# EAGLE schematic mulato-32m (EAGLE 6.4)
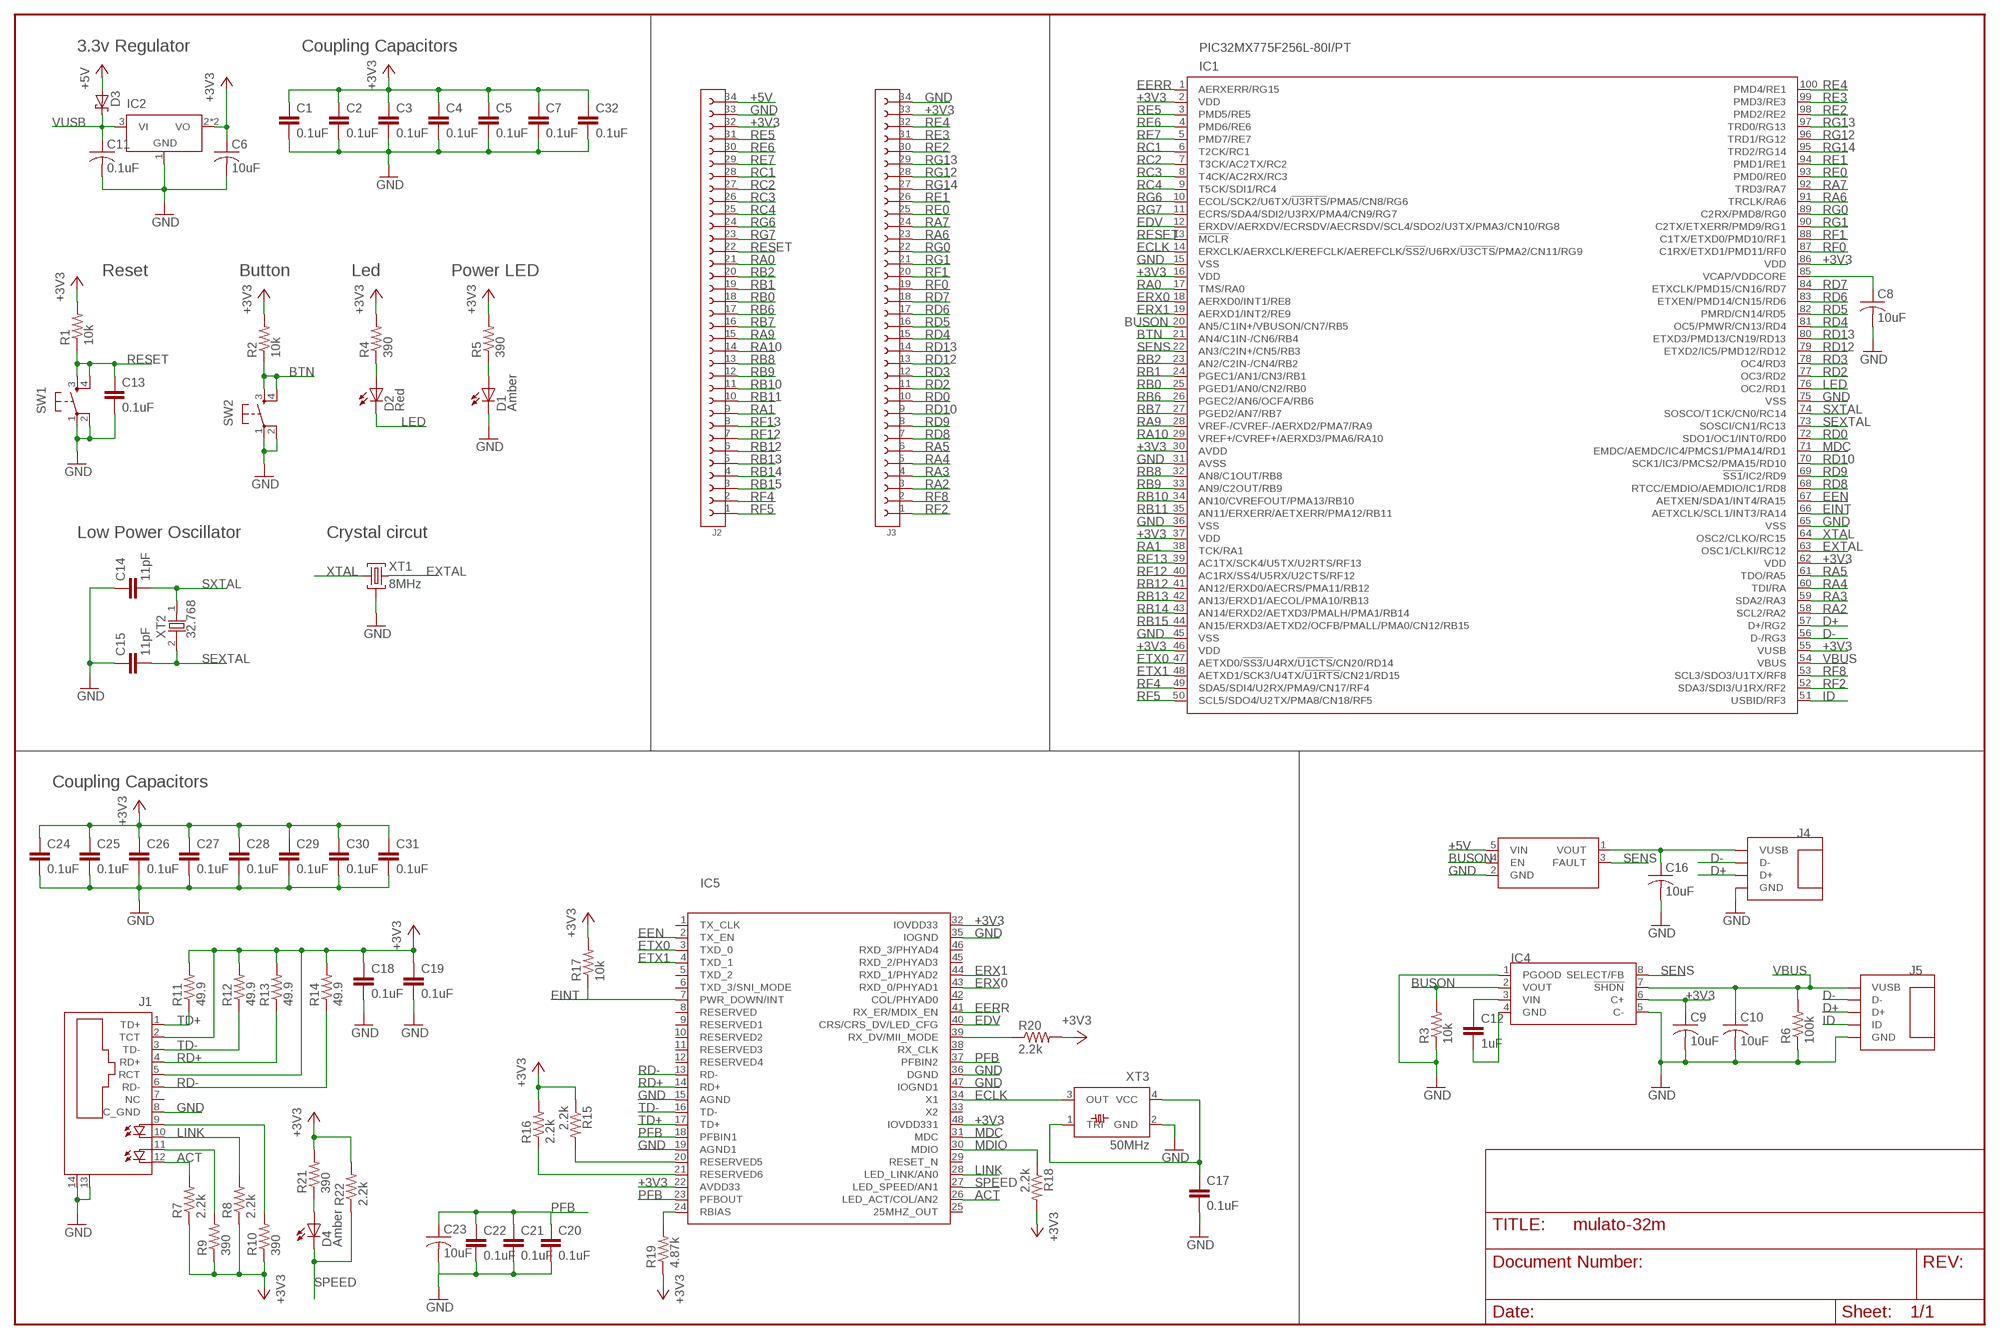
[diagram p0: schematic, sheet 1]

## Parts
C1  0.1uF  C0603C104Z3VAC  [CAPC0603]
C2  0.1uF  C0603C104Z3VAC  [CAPC0603]
C3  0.1uF  C0603C104Z3VAC  [CAPC0603]
C4  0.1uF  C0603C104Z3VAC  [CAPC0603]
C5  0.1uF  C0603C104Z3VAC  [CAPC0603]
C6  10uF  T491A106K016AT  [CAPMP3216-18]
C7  0.1uF  C0603C104Z3VAC  [CAPC0603]
C8  10uF  T491A106K016AT  [CAPMP3216-18]
C9  10uF  T491A106K016AT  [CAPMP3216-18]
C10  10uF  T491A106K016AT  [CAPMP3216-18]
C11  0.1uF  T491A104K050AT  [CAPMP3216-18]
C12  1uF  C0805C105K4RAC  [CAPC0805]
C13  0.1uF  C0603C104Z3VAC  [CAPC0603]
C14  11pF  C0603C110J5GAC  [CAPC0603]
C15  11pF  C0603C110J5GAC  [CAPC0603]
C16  10uF  T491A106K016AT  [CAPMP3216-18]
C17  0.1uF  C0603C104Z3VAC  [CAPC0603]
C18  0.1uF  C0603C104Z3VAC  [CAPC0603]
C19  0.1uF  C0603C104Z3VAC  [CAPC0603]
C20  0.1uF  C0603C104Z3VAC  [CAPC0603]
C21  0.1uF  C0603C104Z3VAC  [CAPC0603]
C22  0.1uF  C0603C104Z3VAC  [CAPC0603]
C23  10uF  T491A106K016AT  [CAPMP3216-18]
C24  0.1uF  C0603C104Z3VAC  [CAPC0603]
C25  0.1uF  C0603C104Z3VAC  [CAPC0603]
C26  0.1uF  C0603C104Z3VAC  [CAPC0603]
C27  0.1uF  C0603C104Z3VAC  [CAPC0603]
C28  0.1uF  C0603C104Z3VAC  [CAPC0603]
C29  0.1uF  C0603C104Z3VAC  [CAPC0603]
C30  0.1uF  C0603C104Z3VAC  [CAPC0603]
C31  0.1uF  C0603C104Z3VAC  [CAPC0603]
C32  0.1uF  C0603C104Z3VAC  [CAPC0603]
D1  Amber  SM0805AC  [D0805]
D2  Red  SM0805HC  [D0805]
D3  MBR0530T1G  [SOT123160X270-2N]
D4  Amber  SM0805AC  [D0805]
IC1  PIC32MX775F256L-80I/PT  [QFP40P1400X1400X100-100N]
IC2  LD1117S33TR  [SOT230P700X180-4N]
IC3  SMTPS2141STR  [SOT95P280X100-5M]
IC4  MCP1253-33X50I/MS  [SOP65P490X109-8M]
IC5  DP83848C  [QFP50P900X900X160-48M]
J1  6605425-1  [RJ45-8N-2LEDS]
J2  61303411121  [PHSP254P8636X254X1154-34S]
J3  61303411121  [PHSP254P8636X254X1154-34S]
J4  292303-1  [USB-A]
J5  1981584-1  [USB-MICRO-B]
R1  10k  CRG0603F10K10  [RESC0603]
R2  10k  CRG0603F10K10  [RESC0603]
R3  10k  CRG0603F10K10  [RESC0603]
R4  390  CRG0603F390R  [RESC0603]
R5  390  CRG0603F390R  [RESC0603]
R6  100k  CRG0603F100K  [RESC0603]
R7  2.2k  CRG0603F2K2  [RESC0603]
R8  2.2k  CRG0603F2K2  [RESC0603]
R9  390  CRG0603F390R  [RESC0603]
R10  390  CRG0603F390R  [RESC0603]
R11  49.9  CRG0603F49R9  [RESC0603]
R12  49.9  CRG0603F49R9  [RESC0603]
R13  49.9  CRG0603F49R9  [RESC0603]
R14  49.9  CRG0603F49R9  [RESC0603]
R15  2.2k  CRG0603F2K2  [RESC0603]
R16  2.2k  CRG0603F2K2  [RESC0603]
R17  10k  CRG0603F10K10  [RESC0603]
R18  2.2k  CRG0603F2K2  [RESC0603]
R19  4.87k  CRG0603F4K87  [RESC0603]
R20  2.2k  CRG0603F2K2  [RESC0603]
R21  390  CRG0603F390R  [RESC0603]
R22  2.2k  CRG0603F2K2  [RESC0603]
SW1  TL3301NF160QJ  [TACT600X600-4J]
SW2  TL3301NF160QJ  [TACT600X600-4J]
XT1  8MHz  AWSCR-8.00MGD-C  [CERAMIC740X340-3N]
XT2  32.768  ABS07-120-32.768KHZ-T  [CEMIC320X150-2N]
XT3  50MHz  ASE-50.000MHZ-ET'  [CEMIC320X250-4N]

## Nets
+3V3: C1.1 C2.1 C3.1 C4.1 C5.1 C6.1 C7.1 C9.1 C18.1 C19.1 C24.1 C25.1 C26.1 C27.1 C28.1 C29.1 C30.1 C31.1 C32.1 IC1.2(VDD) IC1.16(VDD) IC1.30(AVDD) IC1.37(VDD) IC1.46(VDD) IC1.55(VUSB) IC1.62(VDD) IC1.86(VDD) IC2.2(VO) IC2.4(VO) IC4.6(C+) IC5.22(AVDD33) IC5.32(IOVDD33) IC5.48(IOVDD331) J1.2(TCT) J1.5(RCT) J2.32 J3.33 R1.P$2 R2.P$2 R4.P$2 R5.P$2 R7.P$1 R8.P$1 R9.P$1 R10.P$1 R11.P$2 R12.P$2 R13.P$2 R14.P$2 R15.P$1 R16.P$2 R17.P$2 R18.P$2 R19.P$1 R20.P$2 R21.P$2 R22.P$2
+5V: D3.1(A) IC3.5(VIN) J2.34
ACT: IC5.26(LED_ACT/COL/AN2) J1.12(C1) R7.P$2
BTN: IC1.21(AN4/C1IN-/CN6/RB4) R2.P$1 SW2.3(S) SW2.4(S1)
BUSON: IC1.20(AN5/C1IN+/VBUSON/CN7/RB5) IC3.4(EN) IC4.2(VOUT) R3.P$2
D+: IC1.57(D+/RG2) J4.2(D+) J5.3(D+)
D-: IC1.56(D-/RG3) J4.3(D-) J5.2(D-)
ECLK: IC1.14(ERXCLK/AERXCLK/EREFCLK/AEREFCLK/!SS2!/U6RX/!U3CTS!/PMA2/CN11/RG9) IC5.34(X1) XT3.3(OUT)
EDV: IC1.12(ERXDV/AERXDV/ECRSDV/AECRSDV/SCL4/SDO2/U3TX/PMA3/CN10/RG8) IC5.40(CRS/CRS_DV/LED_CFG)
EEN: IC1.67(AETXEN/SDA1/INT4/RA15) IC5.2(TX_EN)
EERR: IC1.1(AERXERR/RG15) IC5.41(RX_ER/MDIX_EN)
EINT: IC1.66(AETXCLK/SCL1/INT3/RA14) IC5.7(PWR_DOWN/INT) R17.P$1
ERX0: IC1.18(AERXD0/INT1/RE8) IC5.43(RXD_0/PHYAD1)
ERX1: IC1.19(AERXD1/INT2/RE9) IC5.44(RXD_1/PHYAD2)
ETX0: IC1.47(AETXD0/!SS3!/U4RX/!U1CTS!/CN20/RD14) IC5.3(TXD_0)
ETX1: IC1.48(AETXD1/SCK3/U4TX/!U1RTS!/CN21/RD15) IC5.4(TXD_1)
EXTAL: IC1.63(OSC1/CLKI/RC12) XT1.3
GND: C1.2 C2.2 C3.2 C4.2 C5.2 C6.2 C7.2 C8.2 C9.2 C10.2 C11.2 C13.2 C14.1 C15.1 C16.2 C17.2 C18.2 C19.2 C20.2 C21.2 C22.2 C23.2 C24.2 C25.2 C26.2 C27.2 C28.2 C29.2 C30.2 C31.2 C32.2 D1.2(C) IC1.15(VSS) IC1.31(AVSS) IC1.36(VSS) IC1.45(VSS) IC1.65(VSS) IC1.75(VSS) IC2.1(GND) IC3.2(GND) IC4.1(PGOOD) IC4.5(C-) IC5.15(AGND) IC5.19(AGND1) IC5.35(IOGND) IC5.36(DGND) IC5.47(IOGND1) J1.8(C_GND) J1.13(CH1) J1.14(CH2) J2.33 J3.34 J4.4(GND) J5.5(GND) R3.P$1 R6.P$1 SW1.1(P) SW1.2(P1) SW2.1(P) SW2.2(P1) XT1.2 XT3.2(GND)
ID: IC1.51(USBID/RF3) J5.4(ID)
LED: D2.2(C) IC1.76(OC2/RD1)
LINK: IC5.28(LED_LINK/AN0) J1.10(C) R8.P$2
MDC: IC1.71(EMDC/AEMDC/IC4/PMCS1/PMA14/RD1) IC5.31(MDC)
MDIO: IC5.30(MDIO) R18.P$1
N$1: C8.1 IC1.85(VCAP/VDDCORE)
N$2: C17.1 XT3.1(TRI) XT3.4(VCC)
N$3: IC5.21(RESERVED6) R16.P$1
N$4: IC5.20(RESERVED5) R15.P$2
N$5: J1.11(A1) R9.P$2
N$6: C16.1 IC3.1(VOUT) J4.1(VUSB)
N$8: C12.1 IC4.3(VIN)
N$9: D1.1(A) R5.P$1
N$10: D2.1(A) R4.P$1
N$11: C12.2 IC4.4(GND)
N$12: J1.9(A) R10.P$2
N$13: IC5.24(RBIAS) R19.P$2
N$14: IC5.39(RX_DV/MII_MODE) R20.P$1
N$15: D4.1(A) R21.P$1
PFB: C20.1 C21.1 C22.1 C23.1 IC5.18(PFBIN1) IC5.23(PFBOUT) IC5.37(PFBIN2)
RA0: IC1.17(TMS/RA0) J2.21
RA1: IC1.38(TCK/RA1) J2.9
RA2: IC1.58(SCL2/RA2) J3.3
RA3: IC1.59(SDA2/RA3) J3.4
RA4: IC1.60(TDI/RA) J3.5
RA5: IC1.61(TDO/RA5) J3.6
RA6: IC1.91(TRCLK/RA6) J3.23
RA7: IC1.92(TRD3/RA7) J3.24
RA9: IC1.28(VREF-/CVREF-/AERXD2/PMA7/RA9) J2.15
RA10: IC1.29(VREF+/CVREF+/AERXD3/PMA6/RA10) J2.14
RB0: IC1.25(PGED1/AN0/CN2/RB0) J2.18
RB1: IC1.24(PGEC1/AN1/CN3/RB1) J2.19
RB2: IC1.23(AN2/C2IN-/CN4/RB2) J2.20
RB6: IC1.26(PGEC2/AN6/OCFA/RB6) J2.17
RB7: IC1.27(PGED2/AN7/RB7) J2.16
RB8: IC1.32(AN8/C1OUT/RB8) J2.13
RB9: IC1.33(AN9/C2OUT/RB9) J2.12
RB10: IC1.34(AN10/CVREFOUT/PMA13/RB10) J2.11
RB11: IC1.35(AN11/ERXERR/AETXERR/PMA12/RB11) J2.10
RB12: IC1.41(AN12/ERXD0/AECRS/PMA11/RB12) J2.6
RB13: IC1.42(AN13/ERXD1/AECOL/PMA10/RB13) J2.5
RB14: IC1.43(AN14/ERXD2/AETXD3/PMALH/PMA1/RB14) J2.4
RB15: IC1.44(AN15/ERXD3/AETXD2/OCFB/PMALL/PMA0/CN12/RB15) J2.3
RC1: IC1.6(T2CK/RC1) J2.28
RC2: IC1.7(T3CK/AC2TX/RC2) J2.27
RC3: IC1.8(T4CK/AC2RX/RC3) J2.26
RC4: IC1.9(T5CK/SDI1/RC4) J2.25
RD0: IC1.72(SDO1/OC1/INT0/RD0) J3.10
RD2: IC1.77(OC3/RD2) J3.11
RD3: IC1.78(OC4/RD3) J3.12
RD4: IC1.81(OC5/PMWR/CN13/RD4) J3.15
RD5: IC1.82(PMRD/CN14/RD5) J3.16
RD6: IC1.83(ETXEN/PMD14/CN15/RD6) J3.17
RD7: IC1.84(ETXCLK/PMD15/CN16/RD7) J3.18
RD8: IC1.68(RTCC/EMDIO/AEMDIO/IC1/RD8) J3.7
RD9: IC1.69(!SS1!/IC2/RD9) J3.8
RD10: IC1.70(SCK1/IC3/PMCS2/PMA15/RD10) J3.9
RD12: IC1.79(ETXD2/IC5/PMD12/RD12) J3.13
RD13: IC1.80(ETXD3/PMD13/CN19/RD13) J3.14
RD+: IC5.14(RD+) J1.4(RD+) R13.P$1
RD-: IC5.13(RD-) J1.6(RD-) R14.P$1
RE0: IC1.93(PMD0/RE0) J3.25
RE1: IC1.94(PMD1/RE1) J3.26
RE2: IC1.98(PMD2/RE2) J3.30
RE3: IC1.99(PMD3/RE3) J3.31
RE4: IC1.100(PMD4/RE1) J3.32
RE5: IC1.3(PMD5/RE5) J2.31
RE6: IC1.4(PMD6/RE6) J2.30
RE7: IC1.5(PMD7/RE7) J2.29
RESET: C13.1 IC1.13(!MCLR) J2.22 R1.P$1 SW1.3(S) SW1.4(S1)
RF0: IC1.87(C1RX/ETXD1/PMD11/RF0) J3.19
RF1: IC1.88(C1TX/ETXD0/PMD10/RF1) J3.20
RF2: IC1.52(SDA3/SDI3/U1RX/RF2) J3.1
RF4: IC1.49(SDA5/SDI4/U2RX/PMA9/CN17/RF4) J2.2
RF5: IC1.50(SCL5/SDO4/U2TX/PMA8/CN18/RF5) J2.1
RF8: IC1.53(SCL3/SDO3/U1TX/RF8) J3.2
RF12: IC1.40(AC1RX/SS4/U5RX/U2CTS/RF12) J2.7
RF13: IC1.39(AC1TX/SCK4/U5TX/U2RTS/RF13) J2.8
RG0: IC1.89(C2RX/PMD8/RG0) J3.22
RG1: IC1.90(C2TX/ETXERR/PMD9/RG1) J3.21
RG6: IC1.10(ECOL/SCK2/U6TX/!U3RTS!/PMA5/CN8/RG6) J2.24
RG7: IC1.11(ECRS/SDA4/SDI2/U3RX/PMA4/CN9/RG7) J2.23
RG12: IC1.96(TRD1/RG12) J3.28
RG13: IC1.97(TRD0/RG13) J3.29
RG14: IC1.95(TRD2/RG14) J3.27
SENS: IC1.22(AN3/C2IN+/CN5/RB3) IC3.3(FAULT) IC4.8(SELECT/FB)
SEXTAL: C15.2 IC1.73(SOSCI/CN1/RC13) XT2.2
SPEED: D4.2(C) IC5.27(LED_SPEED/AN1) R22.P$1
SXTAL: C14.2 IC1.74(SOSCO/T1CK/CN0/RC14) XT2.1
TD+: IC5.17(TD+) J1.1(TD+) R11.P$1
TD-: IC5.16(TD-) J1.3(TD-) R12.P$1
VBUS: C10.1 IC1.54(VBUS) IC4.7(!SHDN) J5.1(VUSB) R6.P$2
VUSB: C11.1 D3.2(C) IC2.3(VI)
XTAL: IC1.64(OSC2/CLKO/RC15) XT1.1
Unconnected: IC5.1(TX_CLK) IC5.5(TXD_2) IC5.6(TXD_3/SNI_MODE) IC5.8(RESERVED) IC5.9(RESERVED1) IC5.10(RESERVED2) IC5.11(RESERVED3) IC5.12(RESERVED4) IC5.25(25MHZ_OUT) IC5.29(RESET_N) IC5.33(X2) IC5.38(RX_CLK) IC5.42(COL/PHYAD0) IC5.45(RXD_2/PHYAD3) IC5.46(RXD_3/PHYAD4) J1.7(NC)

## Notes on the sheet
- 3.3v Regulator | Coupling Capacitors
- Reset | Button | Led | Power LED
- Low Power Oscillator | Crystal circut
- Coupling Capacitors

## Library data of the parts
C1-C5 C7 C13 C17-C22 C24-C32 = kemet-capacitors-ceramic:C?C*VAC: Y5V Dielectric, 6.3 – 50 VDC (Commercial Grade) Description OVERVIEW: KEMET’s Y5V dielectric features an 85°C maximum operating temperature and is considered “general-purpose.” The Electronics Components, Assemblies & Materials Association (EIA) characterizes Z5U dielectric as a Class III material. Components of this classiﬁ cation are ﬁ xed, ceramic dielectric capacitors suited for bypass and decoupling or other applications in which dielectric losses, high insulation resistance and capacitance stability are not of major importance. Y5V exhibits a predictable change in capacitance with respect to time and voltage and displays wide variations in capacitance with reference to ambient temperature. Capacitance change is limited to +22%, -82% from -30°C to +85°C. APPLICATIONS: Typical applications include limited temperature, decoupling and bypass. BENEFITS • -30°C to +85°C operating temperature range • Pb-Free and RoHS Compliant • EIA 0402, 0603, 0805, 1206, and 1210 case sizes • DC voltage ratings of 6.3 V, 10 V, 16 V, 25 V, and 50 V • Capacitance offerings ranging from 0.022 μF to 22 μF • Available capacitance tolerance of +80%/ -20% • Non-polar device, minimizing installation concerns • 100% pure matte tin-plated termination ﬁ nish that allowing for excellent solderability How to Order C 1210 C 226 Z 4 V A C TU Capacitor Class Case Size Specification Series Capacitance Code (pF) Capacitance Tolerance Voltage Dielectric Failure Rate/Design Termination Finish Packaging Grade C = Ceramic 0402 0603 0805 1206 1210 C = Standart 2 signiﬁ cant digits + number of zeros. Use 9 for 1.0 – 9.9 pF Use 8 for 0.5 – .99 pF e.g., 2.2 pF = 229 e.g., 0.5 pF = 508 Z = +80%/-20% 9 = 6.3V 8 = 10V 4 = 16V 3 = 25V 5 = 50 V V = Y5V A = N/A A = 100% Matte Blank = Bulk TU = 7" Reel Unmarked. Ref: Datasheet <http://www.kemet.com/kemet/web/homepage/kechome.nsf/weben/B79D94FAACCDEFCE852579F10063745E/$file/KEM_CC101_COMM_SMD.pdf> Add more variants to C@VAC, just remplace the "@" with a new technologie named according to order code parameters. It is mandatory to fill up the following attributes MANUFACTURER, DESCRIPTION, MOUSER, AVNET, ARROW, FUTURE, NEWARK, DIGIKEY, AVRG-PRICE, OCTOPART-LINK, DATASHEET; AVNET: C0603C104Z3VAC TU; AVRG-PRICE: 0.1; DATASHEET: http://www.kemet.com/kemet/web/homepage/kechome.nsf/weben/B79D94FAACCDEFCE852579F10063745E/$file/KEM_CC101_COMM_SMD.pdf; DESCRIPTION: Capacitores cerámicos de capas múltiples (MLCC) - SMD/SMT0603 25volts 0.1uF Y5V -20+80%; DIGIKEY: 399-1100-2-ND; EAGLEUP: CAPC0603; MANUFACTURER: KEMET; MOUSER: 80-C0603C104Z3V; NEWARK: 31C9013; OCTOPART-LINK: http://octopart.com/c0603c104z3vactu-kemet-98662
C6 C8-C10 C16 C23 = kemet-capacitors-tantalum:T491?*: T491 Industrial Grade MnO2 Series Description OVERVIEW The KEMET T491 Series, designed speciﬁ cally for today’s highly automated surface mount processes and equipment, is the leading choice for surface mount designs. The T491 combines KEMET’s proven solid tantalum technology, acclaimed and respected throughout the world, with the latest in materials, processes and automation, resulting in unsurpassed total performance and value APPLICATIONS Typical applications include decoupling and ﬁ ltering in industrial and automotive end applications such as DC/DC converters, portable electronics, telecommunications, and control units. BENEFITS: • Taped and reeled per EIA 481–1 • Symmetrical, compliant terminations • Optical gold-plated terminations • Laser-marked case • 100% surge current test on C, D, E, U, V, X sizes • Halogen free epoxy • Capacitance 0.1 µF to 1,000 µF • Tolerance ±10%, ±20% • Voltage 2.5 – 50 VDC • Extended range values • Low proﬁ le case sizes • RoHS Compliant and lead-free terminations (See www.kemet.com for transition information) • Operating temperature: -55ºC to +125ºC How to Order T 491 X 157 K 020 A T Capacitor Class Series Case Size Capacitance Code (pF) Capacitance Tolerance Voltage Failure Rate/ Design Lead Material Packaging (C-Spec) T = Tantalum Industrial A, B, C, D, E, R, S, T, U, V, X First two digits represent signiﬁ cant ﬁgures. Third digit speciﬁ es number of zeros. K = ±10% M = ±20% 2R5 = 2.5 V 003 = 3 V 004 = 4 V 006 = 6.3 V 010 = 10 V 016 = 16 V 020 = 20 V 025 = 25 V 035 = 35 V 050 = 50 V A = N/A T = 100% Matte Tin (Sn) Plated* H = Standard Solder Coated (SnPb 5% Pb minimum) G = Gold Plated (A, B, C, D, X only) N = Non-Magnetic 100% Tin (Sn) M = Non-Magnetic (SnPb) Blank = 7" Reel 7280 = 13" Ree Ref: Datasheet <http://www.kemet.com/kemet/web/homepage/kechome.nsf/weben/9F2DE33590D9247E8525788D0059B1E1/$file/KEM_TC101_STD.pdf> Add more variants to T491@, just remplace the "@" with a new technologie named according to order code parameters. It is mandatory to fill up the following attributes MANUFACTURER, DESCRIPTION, MOUSER, AVNET, ARROW, FUTURE, NEWARK, DIGIKEY, AVRG-PRICE, OCTOPART-LINK, DATASHEET; AVRG-PRICE: 0.18; DATASHEET: http://www.kemet.com/kemet/web/homepage/kechome.nsf/weben/9F2DE33590D9247E8525788D0059B1E1/$file/KEM_TC101_STD.pdf; DESCRIPTION: Capacitores de tantalio - SMD sólido 16volt 10uF 10% Lead Free; DIGIKEY: 399-8269-2-ND; EAGLEUP: CAPMP3216-18; MANUFACTURER: KEMET; MOUSER: 80-T491A106K016; OCTOPART-LINK: http://octopart.com/t491a106k016at-kemet-145880
C11 = kemet-capacitors-tantalum:T491?*: T491 Industrial Grade MnO2 Series Description OVERVIEW The KEMET T491 Series, designed speciﬁ cally for today’s highly automated surface mount processes and equipment, is the leading choice for surface mount designs. The T491 combines KEMET’s proven solid tantalum technology, acclaimed and respected throughout the world, with the latest in materials, processes and automation, resulting in unsurpassed total performance and value APPLICATIONS Typical applications include decoupling and ﬁ ltering in industrial and automotive end applications such as DC/DC converters, portable electronics, telecommunications, and control units. BENEFITS: • Taped and reeled per EIA 481–1 • Symmetrical, compliant terminations • Optical gold-plated terminations • Laser-marked case • 100% surge current test on C, D, E, U, V, X sizes • Halogen free epoxy • Capacitance 0.1 µF to 1,000 µF • Tolerance ±10%, ±20% • Voltage 2.5 – 50 VDC • Extended range values • Low proﬁ le case sizes • RoHS Compliant and lead-free terminations (See www.kemet.com for transition information) • Operating temperature: -55ºC to +125ºC How to Order T 491 X 157 K 020 A T Capacitor Class Series Case Size Capacitance Code (pF) Capacitance Tolerance Voltage Failure Rate/ Design Lead Material Packaging (C-Spec) T = Tantalum Industrial A, B, C, D, E, R, S, T, U, V, X First two digits represent signiﬁ cant ﬁgures. Third digit speciﬁ es number of zeros. K = ±10% M = ±20% 2R5 = 2.5 V 003 = 3 V 004 = 4 V 006 = 6.3 V 010 = 10 V 016 = 16 V 020 = 20 V 025 = 25 V 035 = 35 V 050 = 50 V A = N/A T = 100% Matte Tin (Sn) Plated* H = Standard Solder Coated (SnPb 5% Pb minimum) G = Gold Plated (A, B, C, D, X only) N = Non-Magnetic 100% Tin (Sn) M = Non-Magnetic (SnPb) Blank = 7" Reel 7280 = 13" Ree Ref: Datasheet <http://www.kemet.com/kemet/web/homepage/kechome.nsf/weben/9F2DE33590D9247E8525788D0059B1E1/$file/KEM_TC101_STD.pdf> Add more variants to T491@, just remplace the "@" with a new technologie named according to order code parameters. It is mandatory to fill up the following attributes MANUFACTURER, DESCRIPTION, MOUSER, AVNET, ARROW, FUTURE, NEWARK, DIGIKEY, AVRG-PRICE, OCTOPART-LINK, DATASHEET; AVRG-PRICE: 0.23; DATASHEET: http://www.kemet.com/kemet/web/homepage/kechome.nsf/weben/9F2DE33590D9247E8525788D0059B1E1/$file/KEM_TC101_STD.pdf; DESCRIPTION: Capacitores de tantalio - SMD sólido 50V 0.1uF 10% "A"; DIGIKEY: 399-8263-2-ND; EAGLEUP: CAPMP3216-18; MANUFACTURER: KEMET; MOUSER: 80-T491A104K050; NEWARK: 57K1620; OCTOPART-LINK: http://octopart.com/t491a104k050at-kemet-104789
C12 = kemet-capacitors-ceramic:C?C*RAC: X7R Dielectric, 6.3 – 250 VDC (Commercial Grade) Description OVERVIEW: KEMET’s X7R dielectric features a 125°C maximum operating temperature and is considered “temperature stable.” The Electronics Components, Assemblies & Materials Association (EIA) characterizes X7R dielectric as a Class II material. Components of this classiﬁ cation are ﬁ xed, ceramic dielectric capacitors suited for bypass and decoupling applications or for frequency discriminating circuits where Q and stability of capacitance characteristics are not critical. X7R exhibits a predictable change in capacitance with respect to time and voltage and boasts a minimal change in capacitance with reference to ambient temperature. Capacitance change is limited to ±15% from -55°C to +125°C. APPLICATIONS: Typical applications include decoupling, bypass, ﬁ ltering and transient voltage suppression. BENEFITS • -55°C to +125°C operating temperature range • Pb-Free and RoHS Compliant • Temperature stable dielectric • EIA 0402, 0603, 0805, 1206, 1210, 1808, 1812, 1825, 2220, and 2225 case sizes • DC voltage ratings of 6.3 V, 10 V, 16 V, 25 V, 50 V, 100 V, 200 V, and 250 V • Capacitance offerings ranging from 10 pF to 47 μF • Available capacitance tolerances of ±5%, ±10%, and ±20% • Non-polar device, minimizing installation concerns • 100% pure matte tin-plated termination ﬁ nish allowing for excellent solderability • SnPb termination ﬁ nish option available upon request (5% minimum) How to Order C 1206 C 106 M 4 R A C TU Capacitor Class Case Size Specification Series Capacitance Code (pF) Capacitance Tolerance Voltage Dielectric Failure Rate/Design Termination Finish Packaging Grade C = Ceramic 0402 0603 0805 1206 1210 1808 1812 1825 2220 2225 C = Standart 2 signiﬁ cant digits + number of zeros. Use 9 for 1.0 – 9.9 pF Use 8 for 0.5 – .99 pF e.g., 2.2 pF = 229 e.g., 0.5 pF = 508 J = ±5% K = ±10% M = ±20% 9 = 6.3 V 8 = 10 V 4 = 16 V 3 = 25 V 5 = 50 V 1 = 100 V 2 = 200 V A = 250 V R = X7R A = N/A A = 100% Matte Blank = Bulk TU = 7" Reel Unmarked. Ref: Datasheet <http://www.kemet.com/kemet/web/homepage/kechome.nsf/weben/B79D94FAACCDEFCE852579F10063745E/$file/KEM_CC101_COMM_SMD.pdf> Add more variants to C@RAC, just remplace the "@" with a new technologie named according to order code parameters. It is mandatory to fill up the following attributes MANUFACTURER, DESCRIPTION, MOUSER, AVNET, ARROW, FUTURE, NEWARK, DIGIKEY, AVRG-PRICE, OCTOPART-LINK, DATASHEET; EAGLEUP: CAPC0805
C14 C15 = kemet-capacitors-ceramic:C?C*GAC: COG Dielectric, 10 – 200 VDC (Commercial Grade) Description OVERVIEW: KEMET’s C0G dielectric features a 125°C maximum operating temperature and is considered “stable.” The Electronics Components, Assemblies & Materials Association (EIA) characterizes C0G dielectric as a Class I material. Components of this classiﬁ cation are temperature compensating and are suited for resonant circuit applications or those where Q and stability of capacitance characteristics are required. C0G exhibits no change in capacitance with respect to time and voltage and boasts a negligible change in capacitance with reference to ambient temperature. Capacitance change is limited to ±30 ppm/ºC from -55°C to +125°C. BENEFITS • -55°C to +125°C operating temperature range • RoHS Compliant • EIA 0201, 0402, 0603, 0805, 1206, 1210, 1808, 1812, 1825, 2220, and 2225 case sizes • DC voltage ratings of 10 V, 16 V, 25 V, 50 V, 100 V, and 200 V • Capacitance offerings ranging from 0.5 pF up to 0.47 μF • Available capacitance tolerances of ±0.10 pF, ±0.25 pF, ±0.5 pF, ±1%, ±2%, ±5%, ±10%, and ±20% • No piezoelectric noise • Extremely low ESR and ESL • High thermal stability • High ripple current capability • Preferred capacitance solution at line frequencies and into the MHz range • No capacitance change with respect to applied rated DC voltage • Negligible capacitance change with respect to temperature from -55°C to +125°C • No capacitance decay with time • Non-polar device, minimizing installation concerns • 100% pure matte tin-plated termination ﬁ nish allowing for excellent solderability • SnPb plated termination ﬁ nish option available upon request (5% minimum) How to Order C 1206 C 104 J 3 G A C TU Capacitor Class Case Size Specification Series Capacitance Code (pF) Capacitance Tolerance Voltage Dielectric Failure Rate/Design Termination Finish Packaging Grade C = Ceramic 0201 0402 0603 0805 1206 1210 1808 1812 1825 2220 2225 C = Standart 2 signiﬁ cant digits + number of zeros. Use 9 for 1.0 – 9.9 pF Use 8 for 0.5 – .99 pF e.g., 2.2 pF = 229 e.g., 0.5 pF = 508 B = ±0.10 pF C = ±0.25 pF D = ±0.5 pF F = ±1% G = ±2% J = ±5% K = ±10% M = ±20% 8 = 10 V 4 = 16 V 3 = 25 V 5 = 50 V 1 = 100 V 2 = 200 V C = COG A = N/A A = 100% Matte Blank = Bulk TU = 7" Reel Unmarked. Ref: Datasheet <http://www.kemet.com/kemet/web/homepage/kechome.nsf/weben/B79D94FAACCDEFCE852579F10063745E/$file/KEM_CC101_COMM_SMD.pdf> Add more variants to C@GAC, just remplace the "@" with a new technologie named according to order code parameters. It is mandatory to fill up the following attributes MANUFACTURER, DESCRIPTION, MOUSER, AVNET, ARROW, FUTURE, NEWARK, DIGIKEY, AVRG-PRICE, OCTOPART-LINK, DATASHEET; AVRG-PRICE: 0.1; DATASHEET: http://www.kemet.com/kemet/web/homepage/kechome.nsf/weben/B79D94FAACCDEFCE852579F10063745E/$file/KEM_CC101_COMM_SMD.pdf; DESCRIPTION: Capacitores cerámicos de capas múltiples (MLCC) - SMD/SMT 50volts 11pF C0G 5%; DIGIKEY: C0603C110J5GACTU-ND; EAGLEUP: CAPC0603; MANUFACTURER: KEMET; MOUSER: 80-C0603C110J5G; NEWARK: 29T8977; OCTOPART-LINK: http://octopart.com/c0603c110j5gactu-kemet-9138569
D1 D4 = bivar-smleds:SM0805*: Surface Mount LED 0805 Description Bivar Surface Mount 0805 package LED may be used in nearly any lighting or indication application. The miniature package is ideal for small scale applications such as general indication and backlighting. Low power consumption and excellent long life reliability are suitable for battery powered equipment. Bivar offers water clear LED lens for maximum luminous intensity. Wide variety of wavelength and intensity combinations are available to meet any illumination need. The SM0805 LED is packaged in standard tape and reels for pick and place assemblies. ♦ Industry Standard 0805 Package ♦ RoHS Compliant ♦ Small Package and Footprint ♦ Water Clear Lens ♦ Wide Viewing Angle ♦ Ideal for Status Indication, Display, and Backlighting How to Order Type Package Color Clear type Current level SM = Surface mount 0805 A = Amber BW = Blue G = Green H = HE red O = Orange PG = Pure Green R = Read SB = Super Blue SG = Super Green SPG = Super Pure Green SR = Super Red UBW = Ultra Blue UH = Ultra HE Red UO = Ultra Orange UPG = Ultra Pure Green UR = Ultra Red UW = Ultra White UY = Ultra Yellow XPG = Xtra Pure Green Y = Yellow C = Water Clear None = standart L = Low Current Ref: Link <http://www.bivar.com/Products/LEDIndication/LEDs/SurfaceMountLEDs.aspx> Add more variants to SM0805@, just remplace the "@" with a new technologie named according to order code parameters. It is mandatory to fill up the following attributes DESCRIPTION, MOUSER, AVNET, ARROW, FUTURE, NEWARK, DIGIKEY, AVRG-PRICE, OCTOPART-LINK, DATASHEET; AVRG-PRICE: 0.4; DATASHEET: http://www.bivar.com/Images/Cart/SM0805AC.pdf; DESCRIPTION: LED, SMD, 0805, 2 Leads, Amber, Water Clear Lens, 130 Deg Viewing Angle; DIGIKEY: SM0805AC-ND; EAGLEUP: D0805; MOUSER: 749-SM0805AC; NEWARK: 20K3100; OCTOPART-LINK: http://octopart.com/sm0805ac-bivar-5838577
D2 = bivar-smleds:SM0805*: Surface Mount LED 0805 Description Bivar Surface Mount 0805 package LED may be used in nearly any lighting or indication application. The miniature package is ideal for small scale applications such as general indication and backlighting. Low power consumption and excellent long life reliability are suitable for battery powered equipment. Bivar offers water clear LED lens for maximum luminous intensity. Wide variety of wavelength and intensity combinations are available to meet any illumination need. The SM0805 LED is packaged in standard tape and reels for pick and place assemblies. ♦ Industry Standard 0805 Package ♦ RoHS Compliant ♦ Small Package and Footprint ♦ Water Clear Lens ♦ Wide Viewing Angle ♦ Ideal for Status Indication, Display, and Backlighting How to Order Type Package Color Clear type Current level SM = Surface mount 0805 A = Amber BW = Blue G = Green H = HE red O = Orange PG = Pure Green R = Read SB = Super Blue SG = Super Green SPG = Super Pure Green SR = Super Red UBW = Ultra Blue UH = Ultra HE Red UO = Ultra Orange UPG = Ultra Pure Green UR = Ultra Red UW = Ultra White UY = Ultra Yellow XPG = Xtra Pure Green Y = Yellow C = Water Clear None = standart L = Low Current Ref: Link <http://www.bivar.com/Products/LEDIndication/LEDs/SurfaceMountLEDs.aspx> Add more variants to SM0805@, just remplace the "@" with a new technologie named according to order code parameters. It is mandatory to fill up the following attributes DESCRIPTION, MOUSER, AVNET, ARROW, FUTURE, NEWARK, DIGIKEY, AVRG-PRICE, OCTOPART-LINK, DATASHEET; AVRG-PRICE: 0.4; DATASHEET: http://www.bivar.com/images/cart/SM0805HC.pdf; DESCRIPTION: LED estándar - SMD (montaje superficial) HE Red 660 nm Water Clear; DIGIKEY: SM0805HC-ND; EAGLEUP: D0805; MOUSER: 749-SM0805HC; OCTOPART-LINK: http://octopart.com/sm0805hc-bivar-2191580
D3 = on-diodes:MBR0530T*G: SCHOTTKY BARRIER RECTIFIER 0.5 AMPERES 30 VOLTS Description The MBR0530T1/3 uses the Schottky Barrier principle with a large area metal−to−silicon power diode. Ideally suited for low voltage, high frequency rectification or as free wheeling and polarity protection diodes in surface mount applications where compact size and weight are critical to the system. This package also provides an easy to work with alternative to leadless 34 package style. These state−of−the−art devices have the following features: Features  Guardring for Stress Protection  Low Forward Voltage  125C Operating Junction Temperature  Epoxy Meets UL 94, V−0 @ 0.125 in  Package Designed for Optimal Automated Board Assembly  AEC−Q101 Qualified and PPAP Capable  NRVB Prefix for Automotive and Other Applications Requiring Unique Site and Control Change Requirements  All Packages are Pb−Free* How to Order Ref: Datasheet <http://www.mouser.com/ds/2/308/MBR0530T1-D-109532.pdf> Add more variants to MBR0530T@G, just remplace the "@" with a new technologie named according to order code parameters. It is mandatory to fill up the following attributes DESCRIPTION, MOUSER, AVNET, ARROW, FUTURE, NEWARK, DIGIKEY, AVRG-PRICE, OCTOPART-LINK, DATASHEET; EAGLEUP: SOD123
IC1 = mchp_pic32:PIC32MX7*L?: 100 pins, USB, CAN and Ethernet Microcontroller, from 256k to 512k and 64k/128k Ram Description PIC32MX775F256L (256k Flash, 64k Ram) PIC32MX775F512L (512k Flash, 64k Ram) PIC32MX795F512L (512k Flash, 128k Ram) MCU Core -80MHz, 1.56 DMIPS/MHz, 32-bit MIPS M4K® Core -USB 2.0 On-The-Go Peripheral with integrated PHY -10/100 Ethernet MAC with MII/RMII Interfaces -2 x CAN2.0b modules with 1024 buffers -8 Dedicated DMA Channels for USB OTG, Ethernet, and CAN -5 Stage pipeline, Harvard architecture -MIPS16e mode for up to 40% smaller code size -Single cycle multiply and hardware divide unit -32 x 32-bit Core Registers -32 x 32-bit Shadow Registers -Fast context switch and interrupt response MCU System Features -512K Flash (plus 12K boot Flash) -128K RAM (can execute from RAM) -8 Channel General Hardware DMA Controller -Flash prefetch module with 256 Byte cache -Lock instructions or data in cache for fast access -Programmable vector interrupt controller Analog Features -Fast and Accurate 16 channel 10-bit ADC, Max 1 Mega sample per second at +/- 1LSB, conversion available during SLEEP & IDLE -Power Management Modes -RUN, IDLE, and SLEEP modes -Multiple switchable clock modes for each power mode, enables optimum power settings Debug Features -iFlow Trace: Non-intrusive Hardware Instruction Trace port (5 Wires) -8 hardware breakpoints (6 Instruction and 2 Data) -2 wire programming and debugging interface -JTAG interface supporting Programming, Debugging and Boundary scan Other MCU Features -Fail-Safe Clock Monitor - allows safe shutdown if clock fails -2 Internal oscillators (8MHz & 31KHz) -Hardware RTCC (Real-Time Clock and Calendar with Alarms) -Watchdog Timer with separate RC oscillator -Pin compatible with 16-bit PIC® MCUs -Serial Communication Modules allow flexible UART/SPI/I2C™ configuration Device Program Data USB Ethernet CAN Timers/ Capture/ Compare DMA Channels UART SPI I2C ADC channels Comparators PMP/PSP Jtag Trace PIC32MX775F256L 256 64 1 1 2 5/5/5 8/8 6 4 5 16 2 Yes Yes Yes PIC32MX775F512L 256 64 1 1 2 5/5/5 8/8 6 4 5 16 2 Yes Yes Yes PIC32MX795F512L 512 128 1 1 2 5/5/5 8/8 6 4 5 16 2 Yes Yes Yes Ref: Datasheet <http://ww1.microchip.com/downloads/en/DeviceDoc/61156G.pdf>
IC2 = st-ldos:LD1117?*: Low Drop Adjustable Positive Voltage Regulator Description The LD1117 is a low drop voltage regulator able to provide up to 800 mA of output current, available even in adjustable version (VREF= 1.25 V). Concerning fixed versions, are offered the following output voltages: 1.2 V, 1.8 V, 2.5 V, 2.85 V, 3.3 V and 5.0 V. The 2.85 V type is ideal for SCSI-2 lines active termination. The device is supplied in: SOT-223, DPAK, SO-8 and TO-220. The SOT-223 and DPAK surface mount packages optimize the thermal characteristics even offering a relevant space saving effect. High efficiency is assured by NPN pass transistor. In fact in this case, unlike than PNP one, the quiescent current flows mostly into the load. Only a very common 10 μF minimum capacitor is needed for stability. On chip trimming allows the regulator to reach a very tight output voltage tolerance, within ± 1 % at 25 °C. The adjustable LD1117 is pin to pin compatible with the other standard. Adjustable voltage regulators maintaining the better performances in terms of drop and tolerance. KEY FEATURES Low dropout voltage (1 V typ.) 2.85 V device performances are suitable for SCSI-2 active termination Output current up to 800 mA Fixed output voltage of: 1.2 V, 1.8 V, 2.5 V, 3.3 V, 5.0 V Adjustable version availability (VREF= 1.25 V) Internal current and thermal limit Available in ± 1 % (at 25 °C) and 2 % in full temperature range Supply voltage rejection: 75 dB (typ.) How To Order Part Number Package Output Voltaje Temp Range LD1117 S = SOT-223 D = SOIC8 DT = DPACK V = TO220 None = Adjustable 12 = 1.2 volts 18 = 1.8 volts 25 = 2.5 volts 33 = 3.3 volts 50 = 5.0 volts None = 0 to 125 C C = -40 to 125 C Ref: Datasheet <http://www.st.com/internet/com/TECHNICAL_RESOURCES/TECHNICAL_LITERATURE/DATASHEET/CD00000544.pdf> Add more variants to LD1117@, just remplace the "@" with a new technologie named according to order code parameters. It is mandatory to fill up the following attributes MANUFACTURER, DESCRIPTION, MOUSER, AVNET, ARROW, FUTURE, NEWARK, DIGIKEY, AVRG-PRICE, OCTOPART-LINK, DATASHEET; ARROW: LD1117S33TR; AVNET: LD1117S33TR; AVRG-PRICE: 0.76; DATASHEET: http://www.st.com/internet/com/TECHNICAL_RESOURCES/TECHNICAL_LITERATURE/DATASHEET/CD00000544.pdf; DESCRIPTION: Reguladores de interrupción de nivel bajo - LDO 3.3V 0.8A Positive; DIGIKEY: 497-1242-2-ND; EAGLEUP: SOT230P700X180-4N; FUTURE: LD1117S33TR; MANUFACTURER: ST; MOUSER: 511-LD1117S33; NEWARK: 89K0627; OCTOPART-LINK: http://octopart.com/ld1117s33tr-stmicroelectronics-526708
IC3 = st-power-sw:SMTPS21*?TR: Enhanced single channel power switches Description The STMPS2141, STMPS2151, STMPS2161, STMPS2171 power distribution switches are intended for applications where heavy capacitive loads and short circuits are likely to be encountered. These devices incorporate 90 mΩ N-channel MOSFET high-side power switches for power-distribution. These switches are controlled by a logic enable input. KEY FEATURES ■ 90 mΩ high-side MOSFET switch ■ 500/1000 mA continuous current ■ Thermal and short-circuit protection with overcurrent logic output ■ Operating range from 2.7 V to 5.5 V ■ CMOS- and TTL-compatible enable inputs ■ Undervoltage lockout (UVLO) ■ 12 µA maximum standby supply current ■ Ambient temperature range, -40°C to 85°C ■ 8 kV ESD protection ■ Reverse current protection ■ Fault-blanking How To Order Part Number Current Enable Package STMPS21 41 = 500mA 51 = 500mA 61 = 1000mA 71 = 1000mA Active low Active high Active low Active high M = SOIC-8 S= SOT23-5L T = TSSOP8 Ref: Datasheet <http://www.st.com/st-web-ui/static/active/en/resource/technical/document/datasheet/CD00167470.pdf> Add more variants to STMPS21@, just remplace the "@" with a new technologie named according to order code parameters. It is mandatory to fill up the following attributes MANUFACTURER, DESCRIPTION, MOUSER, AVNET, ARROW, FUTURE, NEWARK, DIGIKEY, AVRG-PRICE, OCTOPART-LINK, DATASHEET; EAGLEUP: SOT95P280X100-5N
IC4 = mchp-power:MCP125*?: Low Noise, Positive-Regulated Charge Pump Description The MCP1252/3 are inductorless, positive-regulated charge pump DC/DC converters. The devices generate a regulated fixed (3.3V or 5.0V) or adjustable output voltage. They are specifically designed for applications requiring low noise and high efficiency and are able to deliver up to 120 mA output current. The devices allow the input voltage to be lower or higher than the output voltage, by automatically switching between buck/ boost operation. The MCP1252 has a switching frequency of 650 kHz, avoiding interference with sensitive IF bands. The MCP1253 has a switching frequency of 1 MHz and allows the use of smaller capacitors than the MCP1252, thus saving board space and cost. FEATURES • Inductorless, Buck/Boost, DC/DC Converter • Low Power: 80 µA (Typical) • High Output Voltage Accuracy: - ±2.5% (VOUT Fixed) • 120 mA Output Current • Wide Operating Temperature Range: - -40°C to +85°C • Thermal Shutdown and Short-Circuit Protection • Uses Small Ceramic Capacitors • Switching Frequency: - MCP1252: 650 kHz - MCP1253: 1 MHz • Low Power Shutdown Mode: 0.1 µA (Typical) • Shutdown Input Compatible with 1.8V Logic • VIN Range: 2.0V to 5.5V • Selectable Output Voltage (3.3V or 5.0V) or Adjustable Output Voltage • Space-saving, 8-Lead MSOP • Soft-Start Circuitry to Minimize In-Rush Current How to order Device Operating Frec. Mode Package MCP125 2 = 650 KHz 3 = 1MHz -33x50 = Fixed -ADJ = Adjustable I/MS = micro small outline package Ref: Datasheet <http://www.mouser.com/ds/2/268/21752a-64146.pdf>; EAGLEUP: SOP65P490X109-8M; MANUFACTURER: MICROCHIP
IC5 = interface:DP83848C: Commercial Temperature Single Port 10/100 Mb/s Ethernet Physical Layer Transceiver Description The DP83848C is a robust fully featured 10/100 single port Physical Layer device offering low power consumption, including several intelligent power down states. These low power modes increase overall product reliability due to decreased power dissipation. Supporting multiple intelligent power modes allows the application to use the absolute minimum amount of power needed for operation. The DP83848C includes a 25MHz clock out. This means that the application can be designed with a minimum of external parts, which in turn results in the lowest possible total cost of the solution. The DP83848C easily interfaces to twisted pair media via an external transformer. Both MII and RMII are supported ensuring ease and flexibility of design. The DP83848C features integrated sublayers to support both 10BASE-T and 100BASE-TX Ethernet protocols, which ensures compatibility and interoperability with all other standards based Ethernet solutions. The DP83848C is offered in a small form factor (48 pin LQFP) so that a minimum of board space is needed. Features • Low-power 3.3V, 0.18µm CMOS technology • Low power consumption < 270mW Typical • 3.3V MAC Interface • Auto-MDIX for 10/100 Mb/s • Energy Detection Mode • 25 MHz clock out • SNI Interface (configurable) • RMII Rev. 1.2 Interface (configurable) • MII Serial Management Interface (MDC and MDIO) • IEEE 802.3u MII • IEEE 802.3u Auto-Negotiation and Parallel Detection • IEEE 802.3u ENDEC, 10BASE-T transceivers and filters • IEEE 802.3u PCS, 100BASE-TX transceivers and filters • Integrated ANSI X3.263 compliant TP-PMD physical sublayer with adaptive equalization and Baseline Wander compensation • Error-free Operation up to 137 meters • Programmable LED support Link, 10 /100 Mb/s Mode, Activity, and Collision Detect • Single register access for complete PHY status • 10/100 Mb/s packet BIST (Built in Self Test) How to order Ref: Datasheet <http://www.ti.com/lit/ds/symlink/dp83848c.pdf>
J1 = te-ethernet:6605425-1; EAGLEUP: MAGRJ45-8P2LEDS-TH; MANUFACTURER: TE
J2 J3 = wurth-pin-socket-headers:6130341?
J4 = te-usb:292303-?*: USB A R/A RCPT Description Product Type Features: Size = Standard Series = A Gender = Receptacle Orientation = Right Angle LED = Without PCB Mount Retention Type = Kinked Leg(s) Mechanical Attachment: Mount Location = Top Termination Features: Contact Termination Type = Through Hole Termination Method = Solder Tail Length (mm [in]) = 2.84 [0.112] Dimensions: PCB Thickness, Recommended (mm [in]) = 1.57 [0.062] How to order Common Part Type = Caractericitcs 292303 -1 = Solder tail length 2.84 mm/Kinked legs -2 = Solder tail length 2.29 mm/Kinked legs -4 = Solder tail length 2.84 mm/Kinked legs/High temperature compatible -5 = Solder tail length 2.84 mm/Kinked legs -6 = Solder tail length 2.29 mm/Kinked legs/High temperature compatible -7 = T/H solder legs -9 = High temperature surface mount hold down tab Ref: Datasheet <http://www.te.com/commerce/DocumentDelivery/DDEController?Action=showdoc&DocId=Customer+Drawing%7F292303%7FE8%7Fpdf%7FEnglish%7FENG_CD_292303_E8.pdf%7F292303-1>; EAGLEUP: USB-A-TH+TH
J5 = te-usb:1981584-1: MICRO USB RECEPTACLE STANDARD TYPE AB ASSY Description Product Type Features: Size = Micro Series = AB Gender = Receptacle Orientation = Right Angle LED = Without PCB Mount Retention Type = SMT Hold Down Mechanical Attachment: Mount Location = Top Termination Features: Contact Termination Type = Surface Mount Termination Method = Surface Mount Dimensions: PCB Thickness, Recommended (mm [in]) = 1.00 [0.039] How to order Ref: Datasheet <http://www.te.com/commerce/DocumentDelivery/DDEController?Action=showdoc&DocId=Customer+Drawing%7F1981584%7FD1%7Fpdf%7FEnglish%7FENG_CD_1981584_D1.pdf%7F1981584-1>; EAGLEUP: TE_USB-MICRO-AB-4T
R1-R3 R17 = te-fixed-resistors:CRG?*: Thick Film Chip Resistors 1% and 5% tolerance Description Precious metal terminations are screen printed onto a ceramic base and fired. The resistive element is screen printed and fired and the passivation layer added. Each resistor is trimmed to tolerance by laser. The pre-scribed tile is broken into strips, the end plating is fired on and the strips broken into individual components. Final termination is made by electroplating. Key Features Thick film resistors with a high power to size ratio,ideally suited to industrial and general purpose use. A range from 1 ohm to 10M and tolerances of 1% and 5%. Also including zero ohm links. Suitable for most applications, including high frequency operation, owing to the short lead structure and low capacitance. Seven Package Sizes Terminal finish: Matte Sn MSL Level 2 How to order Common Part Size Tolerance Resistance Value CRG - Thick Film Chip Resistor 0201 0402 0603 0805 1206 2512 F - ±1% J - ±5% 1 ohm (1 ohm) 1R0 1K ohm (1000 ohms) 1K 100K ohm (100000 ohms) 100K 1M ohm (1000000 ohms) 1M Ref: Datasheet <http://www.te.com/commerce/DocumentDelivery/DDEController?Action=showdoc&DocId=Data+Sheet%7F1773204%7FH%7Fpdf%7FEnglish%7FENG_DS_1773204_H.pdf%7F1623095-1>; AVRG-PRICE: 0.1; DATASHEET: http://www.te.com/commerce/DocumentDelivery/DDEController?Action=showdoc&DocId=Data+Sheet%7F1773204%7FH%7Fpdf%7FEnglish%7FENG_DS_1773204_H.pdf%7F1623095-1; DESCRIPTION: Resistores de película gruesa - SMD CRG0603 1% 10K 10KRL; EAGLEUP: RESC0603; MOUSER: 279-CRG0603F10K/10; OCTOPART-LINK: http://octopart.com/crg0603f10k10-tyco+electronics-16077289
R4 R5 R9 R10 R21 = te-fixed-resistors:CRG?*: Thick Film Chip Resistors 1% and 5% tolerance Description Precious metal terminations are screen printed onto a ceramic base and fired. The resistive element is screen printed and fired and the passivation layer added. Each resistor is trimmed to tolerance by laser. The pre-scribed tile is broken into strips, the end plating is fired on and the strips broken into individual components. Final termination is made by electroplating. Key Features Thick film resistors with a high power to size ratio,ideally suited to industrial and general purpose use. A range from 1 ohm to 10M and tolerances of 1% and 5%. Also including zero ohm links. Suitable for most applications, including high frequency operation, owing to the short lead structure and low capacitance. Seven Package Sizes Terminal finish: Matte Sn MSL Level 2 How to order Common Part Size Tolerance Resistance Value CRG - Thick Film Chip Resistor 0201 0402 0603 0805 1206 2512 F - ±1% J - ±5% 1 ohm (1 ohm) 1R0 1K ohm (1000 ohms) 1K 100K ohm (100000 ohms) 100K 1M ohm (1000000 ohms) 1M Ref: Datasheet <http://www.te.com/commerce/DocumentDelivery/DDEController?Action=showdoc&DocId=Data+Sheet%7F1773204%7FH%7Fpdf%7FEnglish%7FENG_DS_1773204_H.pdf%7F1623095-1>; AVRG-PRICE: 0.1; DATASHEET: http://www.te.com/commerce/DocumentDelivery/DDEController?Action=showdoc&DocId=Data+Sheet%7F1773204%7FH%7Fpdf%7FEnglish%7FENG_DS_1773204_H.pdf%7F1623095-1; DESCRIPTION: Resistores de película gruesa - SMD 0603 390Ohms 1/10W 50V; EAGLEUP: RESC0603; MOUSER: 279-CRG0603F390R; OCTOPART-LINK: http://octopart.com/crg0603f390r-tyco+electronics-16077369
R6 = te-fixed-resistors:CRG?*: Thick Film Chip Resistors 1% and 5% tolerance Description Precious metal terminations are screen printed onto a ceramic base and fired. The resistive element is screen printed and fired and the passivation layer added. Each resistor is trimmed to tolerance by laser. The pre-scribed tile is broken into strips, the end plating is fired on and the strips broken into individual components. Final termination is made by electroplating. Key Features Thick film resistors with a high power to size ratio,ideally suited to industrial and general purpose use. A range from 1 ohm to 10M and tolerances of 1% and 5%. Also including zero ohm links. Suitable for most applications, including high frequency operation, owing to the short lead structure and low capacitance. Seven Package Sizes Terminal finish: Matte Sn MSL Level 2 How to order Common Part Size Tolerance Resistance Value CRG - Thick Film Chip Resistor 0201 0402 0603 0805 1206 2512 F - ±1% J - ±5% 1 ohm (1 ohm) 1R0 1K ohm (1000 ohms) 1K 100K ohm (100000 ohms) 100K 1M ohm (1000000 ohms) 1M Ref: Datasheet <http://www.te.com/commerce/DocumentDelivery/DDEController?Action=showdoc&DocId=Data+Sheet%7F1773204%7FH%7Fpdf%7FEnglish%7FENG_DS_1773204_H.pdf%7F1623095-1>; DESCRIPTION: Resistores de película gruesa - SMD 0603 100kOhms 1/10W 50V; EAGLEUP: RESC0603
R7 R8 R15 R16 R18 R20 R22 = te-fixed-resistors:CRG?*: Thick Film Chip Resistors 1% and 5% tolerance Description Precious metal terminations are screen printed onto a ceramic base and fired. The resistive element is screen printed and fired and the passivation layer added. Each resistor is trimmed to tolerance by laser. The pre-scribed tile is broken into strips, the end plating is fired on and the strips broken into individual components. Final termination is made by electroplating. Key Features Thick film resistors with a high power to size ratio,ideally suited to industrial and general purpose use. A range from 1 ohm to 10M and tolerances of 1% and 5%. Also including zero ohm links. Suitable for most applications, including high frequency operation, owing to the short lead structure and low capacitance. Seven Package Sizes Terminal finish: Matte Sn MSL Level 2 How to order Common Part Size Tolerance Resistance Value CRG - Thick Film Chip Resistor 0201 0402 0603 0805 1206 2512 F - ±1% J - ±5% 1 ohm (1 ohm) 1R0 1K ohm (1000 ohms) 1K 100K ohm (100000 ohms) 100K 1M ohm (1000000 ohms) 1M Ref: Datasheet <http://www.te.com/commerce/DocumentDelivery/DDEController?Action=showdoc&DocId=Data+Sheet%7F1773204%7FH%7Fpdf%7FEnglish%7FENG_DS_1773204_H.pdf%7F1623095-1>; DESCRIPTION: Resistores de película gruesa - SMD 2.2KOhms 1/10W 50V; EAGLEUP: RESC0603
R11-R14 = te-fixed-resistors:CRG?*: Thick Film Chip Resistors 1% and 5% tolerance Description Precious metal terminations are screen printed onto a ceramic base and fired. The resistive element is screen printed and fired and the passivation layer added. Each resistor is trimmed to tolerance by laser. The pre-scribed tile is broken into strips, the end plating is fired on and the strips broken into individual components. Final termination is made by electroplating. Key Features Thick film resistors with a high power to size ratio,ideally suited to industrial and general purpose use. A range from 1 ohm to 10M and tolerances of 1% and 5%. Also including zero ohm links. Suitable for most applications, including high frequency operation, owing to the short lead structure and low capacitance. Seven Package Sizes Terminal finish: Matte Sn MSL Level 2 How to order Common Part Size Tolerance Resistance Value CRG - Thick Film Chip Resistor 0201 0402 0603 0805 1206 2512 F - ±1% J - ±5% 1 ohm (1 ohm) 1R0 1K ohm (1000 ohms) 1K 100K ohm (100000 ohms) 100K 1M ohm (1000000 ohms) 1M Ref: Datasheet <http://www.te.com/commerce/DocumentDelivery/DDEController?Action=showdoc&DocId=Data+Sheet%7F1773204%7FH%7Fpdf%7FEnglish%7FENG_DS_1773204_H.pdf%7F1623095-1>; DESCRIPTION: Resistores de película gruesa - SMD CRG0603 1% 49R9; EAGLEUP: RESC0603
R19 = te-fixed-resistors:CRG?*: Thick Film Chip Resistors 1% and 5% tolerance Description Precious metal terminations are screen printed onto a ceramic base and fired. The resistive element is screen printed and fired and the passivation layer added. Each resistor is trimmed to tolerance by laser. The pre-scribed tile is broken into strips, the end plating is fired on and the strips broken into individual components. Final termination is made by electroplating. Key Features Thick film resistors with a high power to size ratio,ideally suited to industrial and general purpose use. A range from 1 ohm to 10M and tolerances of 1% and 5%. Also including zero ohm links. Suitable for most applications, including high frequency operation, owing to the short lead structure and low capacitance. Seven Package Sizes Terminal finish: Matte Sn MSL Level 2 How to order Common Part Size Tolerance Resistance Value CRG - Thick Film Chip Resistor 0201 0402 0603 0805 1206 2512 F - ±1% J - ±5% 1 ohm (1 ohm) 1R0 1K ohm (1000 ohms) 1K 100K ohm (100000 ohms) 100K 1M ohm (1000000 ohms) 1M Ref: Datasheet <http://www.te.com/commerce/DocumentDelivery/DDEController?Action=showdoc&DocId=Data+Sheet%7F1773204%7FH%7Fpdf%7FEnglish%7FENG_DS_1773204_H.pdf%7F1623095-1>; DESCRIPTION: Resistores de película gruesa - SMD CRG0603 1% 4K87; EAGLEUP: RESC0603
SW1 SW2 = esw-tactile-sw:TL3301?*J: 6mm x 6mm Push Button, J lead Description Designed for SMT applications, each model has different features ranging from low profile designs, normally opened, right angle, and dual action. Applications include telecommunications, consumer electronics, audio/visual, medical devices, testing/instrumentation and computer/peripherals. SPECIFICATIONS: RATING: 50mA 12VDC MECHANICAL LIFE: ≥100,000 Cycles CONTACT RESISTANCE: 100mΩ Max. INSULATION RESISTANCE: 100MΩ Min. DIELECTRIC STRENGTH: 250VAC ACTUATION FORCE: 100gf ± 50gf; 160gf± 50gf; 260gf ± 50gf How to order Series Model Actuator Operating Force Contact Material Termination TL 3301 N = 4.3mm A = 5.0mm E = 7.3mm F = 7.0mm C = 8.0mm P = 8.5mm B = 9.5mm D =13.0mm F100 F160 F260 R - Gold Q - Silver J - J-lead Ref: Datasheet <http://www.e-switch.com/Portals/0/Series_Pdf/TL3301.pdf> Add more variants to TL3301@J, just remplace the "@" with a new technologie named according to order code parameters. It is mandatory to fill up the following attributes MANUFACTURER, DESCRIPTION, MOUSER, AVNET, ARROW, FUTURE, NEWARK, DIGIKEY, AVRG-PRICE, OCTOPART-LINK, DATASHEET; AVRG-PRICE: 0.41; DATASHEET: http://www.e-switch.com/Portals/0/Series_Pdf/TL3301.pdf; DESCRIPTION: Interruptores táctiles SMT Tact Switch SPST-NO 0.05A 12V J; DIGIKEY: EG4376TR-ND; EAGLEUP: TACT600X600X430-4J; MANUFACTURER: E-SWITCH; MOUSER: 612-TL3301NF160QJ; NEWARK: 15N4501; OCTOPART-LINK: http://octopart.com/tl3301nf160qj-e-switch-1252925
XT1 = abracon-resonators:AWSCR-*MGD-C: Built-in capacitance • Low Resonant impedance • 1.84MHz to 8MHz • 7.4 x 3.4 mm Description FEATURES: • Built-in load capacitors • Suitable for RoHS compliant reflow • Low cost solution for cost sensitive applications • Low resonant impedance APPLICATIONS: • Remote controls, Microprocessor clocks, DVD & CD-ROMs, Electric appliances • Consumer electronics How to Order Cristal Frequency in MHz Load Capacitance Packaging AWSCR 12.00MGD-C Contact ABRACON for Built-in Capacitance options Blank: Bulk T: Tape & Reel Ref: Datasheet <http://www.abracon.com/Resonators/AWSCR_MGD.pdf> Add more variants to AWSCR@, just remplace the "@" with a new technologie named according to order code parameters. It is mandatory to fill it up the following attributes MANUFACTURER, DESCRIPTION, MOUSER, AVNET, ARROW, FUTURE, NEWARK, DIGIKEY, AVRG-PRICE, OCTOPART-LINK, DATASHEET; EAGLEUP: CERAMIC740X340-3N; MANUFACTURER: ABRACON
XT2 = abracon-crystals:ABS07-120-32.768KHZ-T: 3.2 x 1.5 x 0.9mm • Low Profile, 32.768kHz 6pF, ESR Optimized Tuning Fork Crystal Description FEATURES: • Guaranteed ESR of 60kΩ Maximum for Low Power Designs • 0.9mm height ideal for high density circuit boards • Seam sealed ceramic package offers excellent environmental & heat resistance • Extended Operating temperature of -40°C to +85°C for industrial applications APPLICATIONS: • Power sensitive designs requiring Low ESR Crystal • Communication & measurement equipment • Commercial, Consumer & Industrial applications • Wireless communications • PDA and Smartphone How to Order ABS07-120-32.768kHz-T Ref: Datasheet <http://www.abracon.com/Resonators/ABS07-120-32.768kHz-T.pdf> It is mandatory to fill it up the following attributes MANUFACTURER, DESCRIPTION, MOUSER, AVNET, ARROW, FUTURE, NEWARK, DIGIKEY, AVRG-PRICE, OCTOPART-LINK, DATASHEET; EAGLEUP: CEMIC320X150-2N; MANUFACTURER: ABRACON
XT3 = abracon-oscillators:ASE*: 3.3Vdc CMOS Compatible SMD . 0.625MHz - 200MHz Description FEATURES: • Low height 1.0mm max • Tri-state function • Low current consumption 20mA max for 200MHz • Low RMS jitter 5ps max • Suitable for RoHS reflow • Available for tight stability option APPLICATIONS: • CCD clock for VTR camera • Equipment connected to PC or PC cards • PDA, wireless communication. • Laptop, SSD (Solid State Drive) How to Order Cristal Frequency in MHz Operating Temp Freq. Stability Packaging ASE e .g. 3.579545 MHz 14.31818 MHz 26.000MHz I: 0°C ~ +60°C D: -10°C ~ +60°C E: -20°C ~ +70°C F: -30°C ~ +70°C N: -30°C ~ +85°C L: -40°C ~ +85°C J: ± 20 ppm R: ± 25 ppm K: ± 30 ppm H: ± 35 ppm B: ± 40 ppm C: ± 50 ppm Blank: Bulk T: Tape & Reel Ref: Datasheet ASE <http://www.abracon.com/Oscillators/ASEseries.pdf> Add more variants to ABLS@, just remplace the "@" with a new technologie named according to order code parameters. It is mandatory to fill it up the following attributes MANUFACTURER, DESCRIPTION, MOUSER, AVNET, ARROW, FUTURE, NEWARK, DIGIKEY, AVRG-PRICE, OCTOPART-LINK, DATASHEET; DATASHEET: http://www.abracon.com/Oscillators/ASEseries.pdf; DESCRIPTION: OSC 3.3V 100ppm Ceramic -20+70C; M-PRICE: 3.12; MANUFACTURER: ABRACON; MOUSER: 815-ASE-50.0M-E-T